# Altium project STLINKV2.PrjPcb (part 1 of 2)
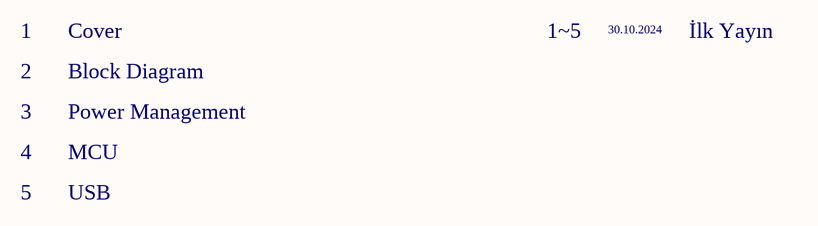
[diagram p0: Cover.SchDoc]
SheetSize: A3; ReleaseDate: 30.10.2024; ProjectDescription: STLINK_V2; PreparedBy: Aslı Kurt
5 sheets, 48 parts. Net scope: global (net labels, ports and power ports of the same name join across sheets).
Board file: STLINKV2.PcbDoc
Sheets:
  Cover.SchDoc
  BlockDiagram.SchDoc
  PowerManagement.SchDoc
  MCU.SchDoc
  USB.SchDoc

## Sheet Cover.SchDoc
size A3; SheetNumber: 1; SheetTotal: 5

### Notes on the sheet
- 1
- 2
- Cover
- Block Diagram
- 1~5
- 30.10.2024
- İlk Yayın
- 3
- Power Management
- 4
- 5
- MCU
- USB
- İÇİNDEKİLER / CONTENTS
- REVİZYON / REVISION
- ÜRETİM NOTLARI / PRODUCTION NOTES
- Sayfa Nu.
- Page No
- Açıklama / Description
- Tarih
- Date
- Board Features
- Kart Özellikleri
- Üretim Çıktıları
- Gerber Files
- Ekler
- Attachments
- İLETİŞİM / CONTACT
- DOSYA ADI / FILE NAME
- TANIM / DESCRIPTION
- HAZIRLAYAN / PREPARED BY
- YAYIN TARİHİ / REL. DATE
- BOYUT / SIZE
- SAYFA / SHEET
- /

## Sheet BlockDiagram.SchDoc
size A3; SheetNumber: 2; SheetTotal: 5
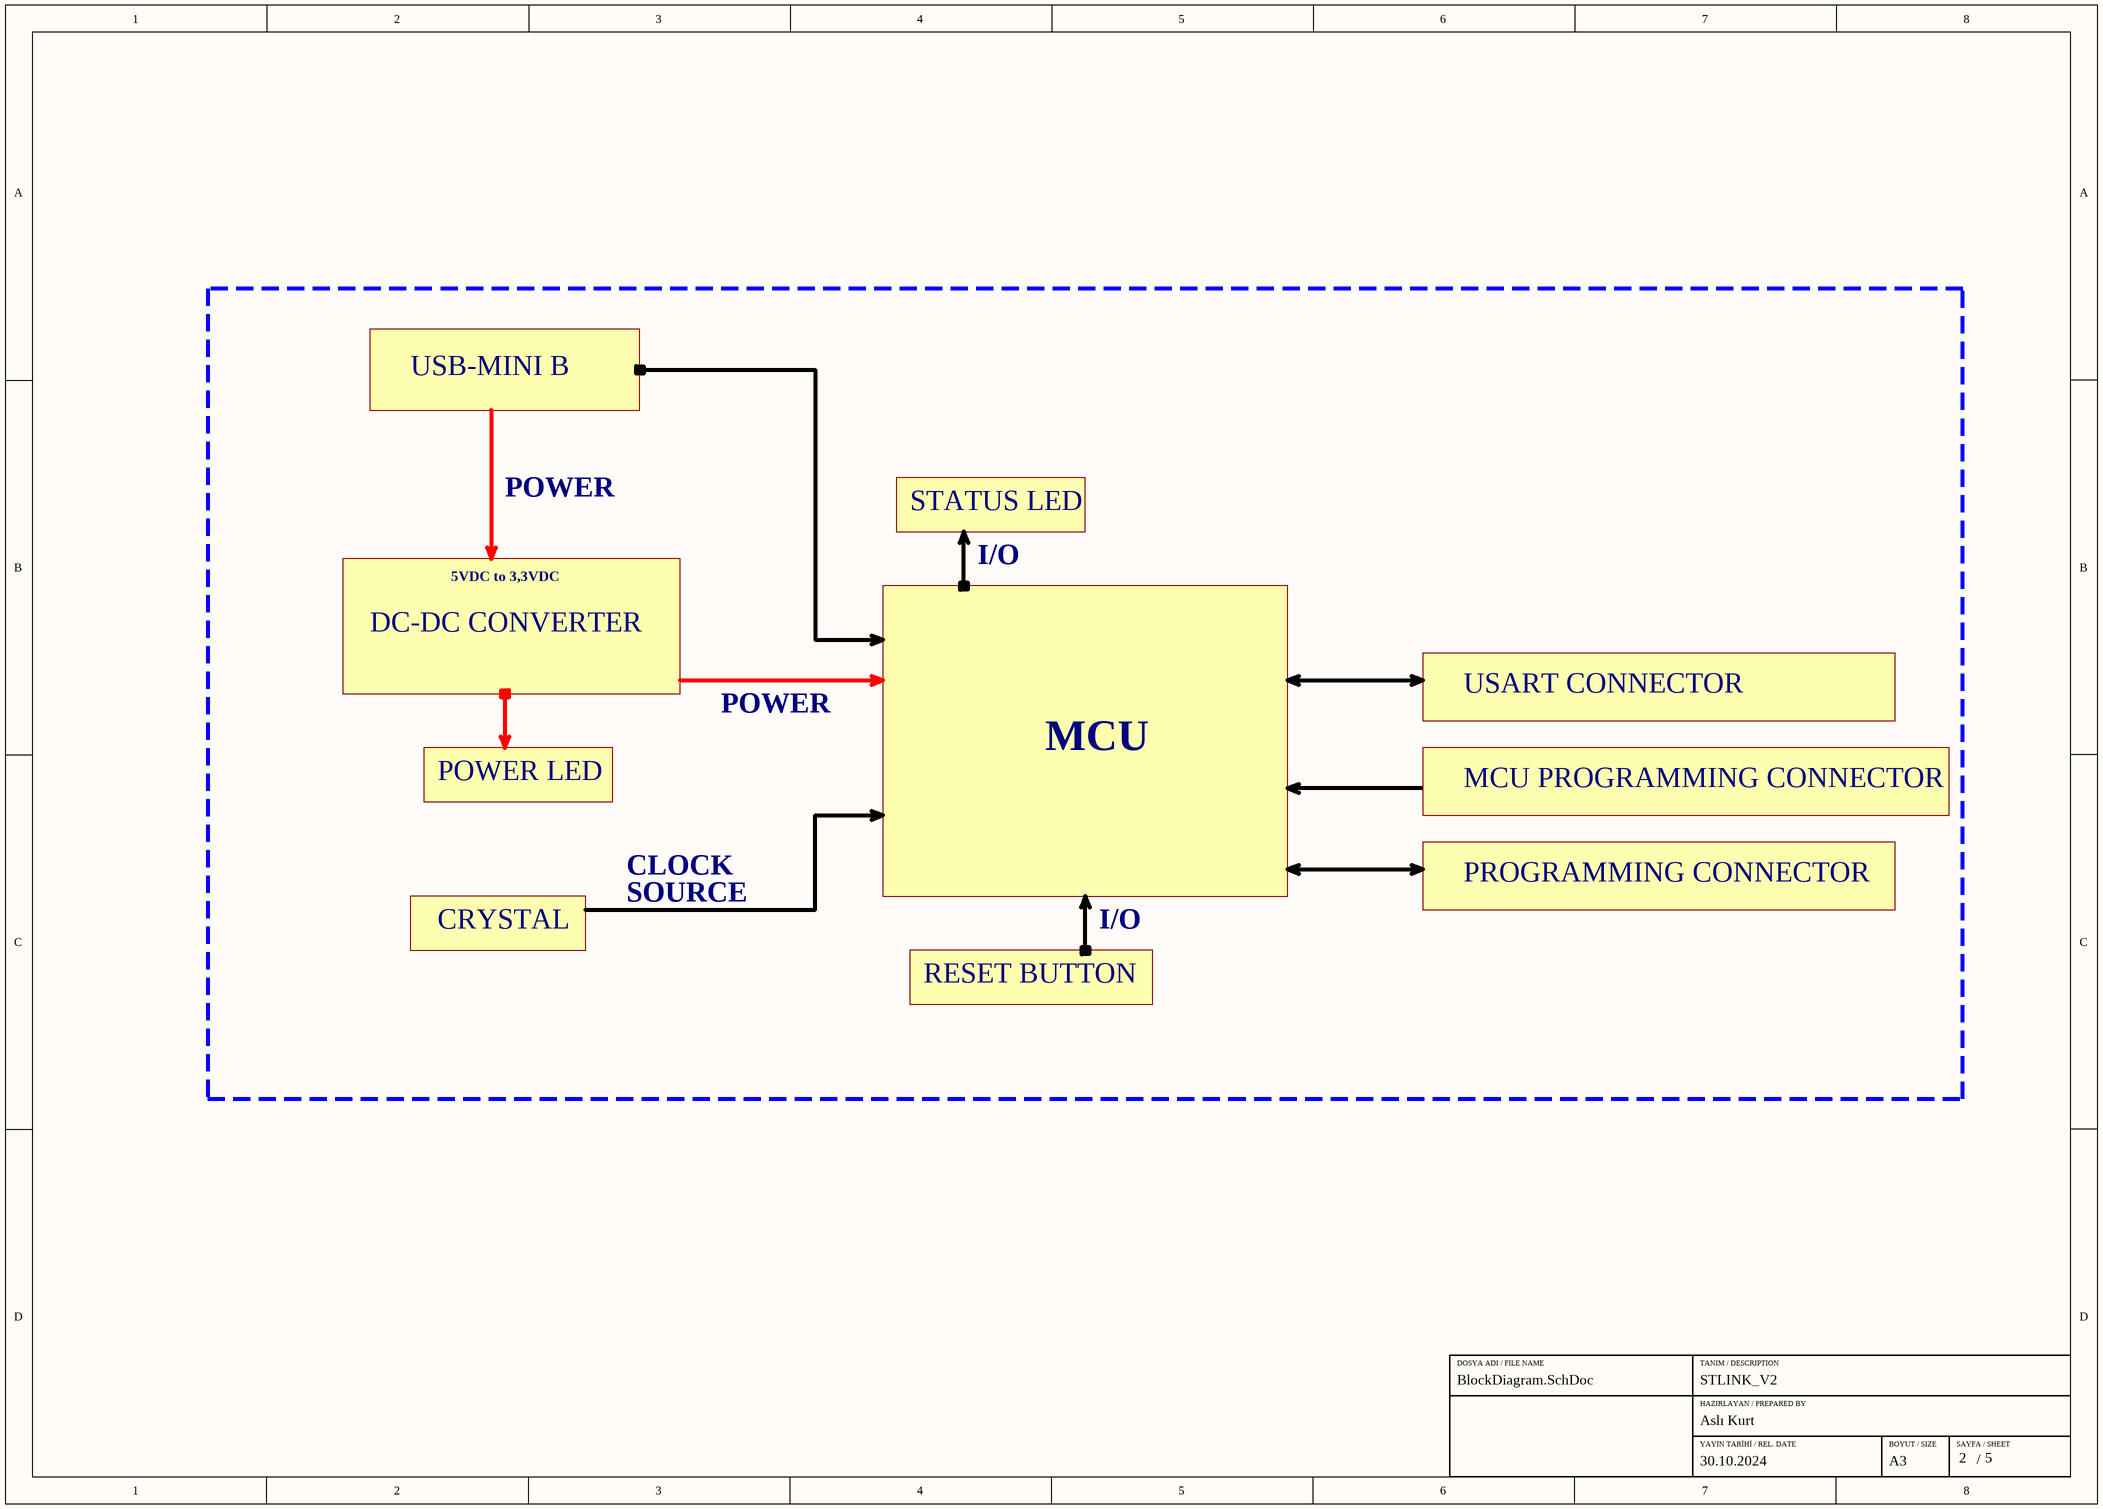
[diagram p1: BlockDiagram.SchDoc]

### Notes on the sheet
- USB-MINI B
- POWER
- STATUS LED
- 5VDC to 3,3VDC
- I/O
- DC-DC CONVERTER
- USART CONNECTOR
- POWER LED
- MCU
- MCU PROGRAMMING CONNECTOR
- CLOCK
- SOURCE
- PROGRAMMING CONNECTOR
- CRYSTAL
- RESET BUTTON
- DOSYA ADI / FILE NAME
- TANIM / DESCRIPTION
- HAZIRLAYAN / PREPARED BY
- YAYIN TARİHİ / REL. DATE
- BOYUT / SIZE
- SAYFA / SHEET
- /

## Sheet PowerManagement.SchDoc
size A3; SheetNumber: 3; SheetTotal: 5
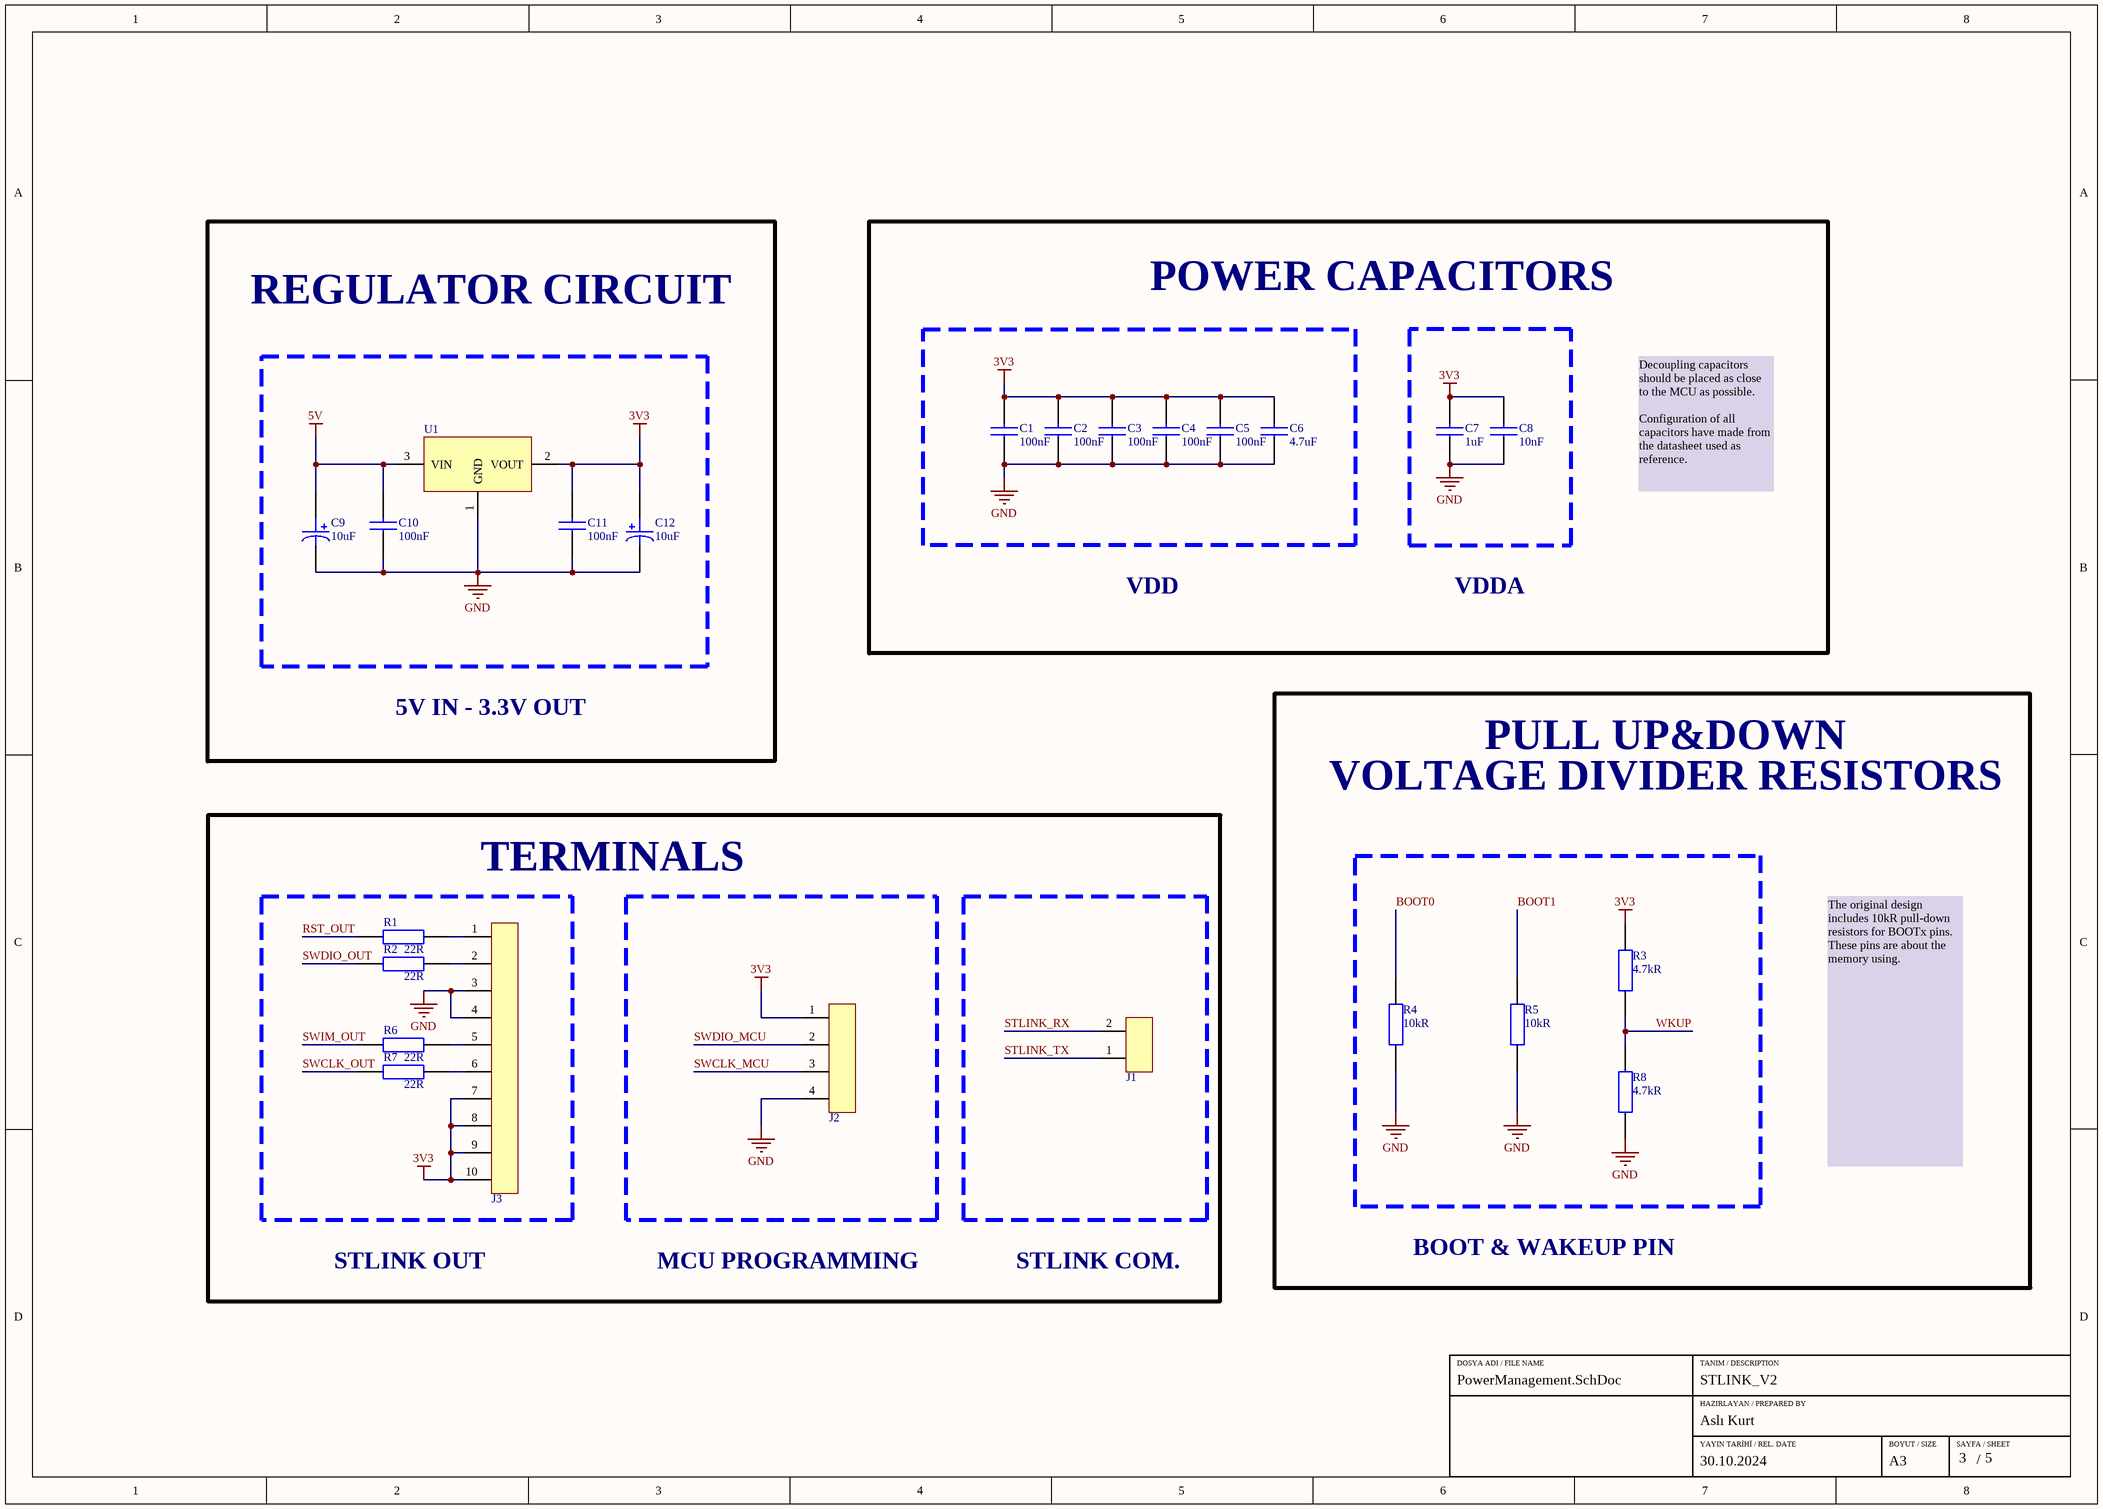
[diagram p2: PowerManagement.SchDoc]

### Parts
C1  Capacitance: 100nF  [CAP_0603]  (hidden comment: C0603C104K5RACTU)
C2  Capacitance: 100nF  [CAP_0603]  (hidden comment: C0603C104K5RACTU)
C3  Capacitance: 100nF  [CAP_0603]  (hidden comment: C0603C104K5RACTU)
C4  Capacitance: 100nF  [CAP_0603]  (hidden comment: C0603C104K5RACTU)
C5  Capacitance: 100nF  [CAP_0603]  (hidden comment: C0603C104K5RACTU)
C6  Capacitance: 4.7uF  [CAP_0805]  (hidden comment: CL21A475KAQNNNE)
C7  Capacitance: 1uF  [CAP_0805]  (hidden comment: CL21B105KBFNNNE)
C8  Capacitance: 10nF  [CAP_0603]  (hidden comment: 0603B103K160CT)
C9  Capacitance: 10uF  [CAP_1206_TANT]  (hidden comment: T491A106K010AT)
C10  Capacitance: 100nF  [CAP_0603]  (hidden comment: C0603C104K5RACTU)
C11  Capacitance: 100nF  [CAP_0603]  (hidden comment: C0603C104K5RACTU)
C12  Capacitance: 10uF  [CAP_1206_TANT]  (hidden comment: T491A106K010AT)
J1  61300211121  [2x1 Male Header 2.54mm]  (value not drawn)
J2  2.54mm  [4x1 Pinout]  (value not drawn)
J3  SBH11-PBPC-D05-RA-BK  [5x2 Male Header 2.54mm Shrouded - 4 Wall]  (value not drawn)
R1  Resistance: 22R  [RES_0201]  (hidden comment: AC0201FR-0722RL)
R2  Resistance: 22R  [RES_0201]  (hidden comment: AC0201FR-0722RL)
R3  Resistance: 4.7kR  [RES_0603]  (hidden comment: RC0603JR-074K7L)
R4  Resistance: 10kR  [RES_0603]  (hidden comment: RC0603FR-0710KL)
R5  Resistance: 10kR  [RES_0603]  (hidden comment: RC0603FR-0710KL)
R6  Resistance: 22R  [RES_0201]  (hidden comment: AC0201FR-0722RL)
R7  Resistance: 22R  [RES_0201]  (hidden comment: AC0201FR-0722RL)
R8  Resistance: 4.7kR  [RES_0603]  (hidden comment: RC0603JR-074K7L)
U1  LM1117MPX-33NOPB  [SOT223]  (value not drawn)

### Blocks framed on the sheet
REGULATOR CIRCUIT: C9-C12 U1
POWER CAPACITORS: C1-C8
TERMINALS: J1-J3 R1 R2 R6 R7

### Nets
3V3: C1.2 C2.2 C3.2 C4.2 C5.2 C6.2 C7.2 C8.2 C11.2 C12.1 J2.1 J3.7 J3.8 J3.9 J3.10 R3.2 U1.2(VOUT)
5V: C9.1 C10.2 U1.3(VIN)
GND: C1.1 C2.1 C3.1 C4.1 C5.1 C6.1 C7.1 C8.1 C9.2 C10.1 C11.1 C12.2 J2.4 J3.3 J3.4 R4.2 R5.2 R8.1 U1.1(GND)
BOOT0: R4.1
BOOT1: R5.1
RST_OUT: R1.1
STLINK_RX: J1.2
STLINK_TX: J1.1
SWCLK_MCU: J2.3
SWCLK_OUT: R7.1
SWDIO_MCU: J2.2
SWDIO_OUT: R2.1
SWIM_OUT: R6.1
WKUP: R3.1 R8.2
NetJ3_1: J3.1 R1.2
NetJ3_2: J3.2 R2.2
NetJ3_5: J3.5 R6.2
NetJ3_6: J3.6 R7.2

### Notes on the sheet
- Decoupling capacitors should be placed as close to the MCU as possible.
  Configuration of all capacitors have made from the datasheet used as reference.
- VDD
- VDDA
- 5V IN - 3.3V OUT
- PULL UP&DOWN
- VOLTAGE DIVIDER RESISTORS
- The original design includes 10kR pull-down resistors for BOOTx pins. These pins are about the memory using.
- STLINK OUT
- MCU PROGRAMMING
- STLINK COM.
- BOOT & WAKEUP PIN
- DOSYA ADI / FILE NAME
- TANIM / DESCRIPTION
- HAZIRLAYAN / PREPARED BY
- YAYIN TARİHİ / REL. DATE
- BOYUT / SIZE
- SAYFA / SHEET
- /

### Library data of the parts
C1-C5 C10 C11 = CAP CER 100nF 0603: CAP CER 100nF %10 0603 SMD; Manufacturer: KEMET; DesignedBy: Aslı Kurt; Dielectric Material: Ceramic; Voltage Rating (DC): 50V; Tolerance: 10%; Dielectric: X7R; Dissipation Factor: 2.5%; Supplier 1: Digi-Key; Manufacturer Part Number: C0603C104K5RACTU; RoHS: Yes; Category: Ceramic Capacitors; Stock 1: 1666186; Pricing 1: 1=0,12000, 10=0,08500, 50=0,04620, 100=0,03770, 500=0,02696, 1000=0,02118 (USD); Mount: Surface Mount; Case/Package: 0603; Number of Pins: 2; Case Code (Metric): 1608; Case Code (Imperial): 0603; Contact Plating: Tin,Matte; Min Operating Temperature: -55°C; Max Operating Temperature: 125°C; Packaging: Tape and Reel; Package Quantity: 1; Termination: SMD/SMT; Voltage: 50V; Voltage Rating: 50V; Series: SMD Comm X7R; Length: 0.063inch; Width: 0.031inch; Height: 0.8mm; Thickness: 0.034inch; Lead Pitch: 0.7mm; Depth: 0.8mm; Radiation Hardening: No; RoHS Compliant: Yes; REACH SVHC: No SVHC; ComponentLink1URL: https://datasheet.ciiva.com/7823/kem-c1002-x7r-smd-7823591.pdf?src-supplier=Element14; ComponentLink1Description: https://datasheet.ciiva.com/7823/kem-c1002-x7r-smd-7823591.pdf?src-supplier=Element14; ComponentLink2URL: https://datasheet.ciiva.com/14602/70095383-14602583.pdf?src-supplier=Allied+Electronics; ComponentLink2Description: https://datasheet.ciiva.com/14602/70095383-14602583.pdf?src-supplier=Allied+Electronics; ComponentLink3URL: https://datasheet.ciiva.com/5999/kem-c1002-x7r-smd-5999400.pdf?src-supplier=Farnell; ComponentLink3Description: https://datasheet.ciiva.com/5999/kem-c1002-x7r-smd-5999400.pdf?src-supplier=Farnell; ComponentLink4URL: https://datasheet.ciiva.com/7823/kem-c1002-x7r-smd-7823592.pdf?src-supplier=Element14; ComponentLink4Description: https://datasheet.ciiva.com/7823/kem-c1002-x7r-smd-7823592.pdf?src-supplier=Element14; ComponentLink5URL: https://datasheet.ciiva.com/28645/1851736-28645640.pdf?src-supplier=Element14; ComponentLink5Description: https://datasheet.ciiva.com/28645/1851736-28645640.pdf?src-supplier=Element14; ComponentLink6URL: https://datasheet.ciiva.com/14585/70095383-14585209.pdf?src-supplier=Allied+Electronics; ComponentLink6Description: https://datasheet.ciiva.com/14585/70095383-14585209.pdf?src-supplier=Allied+Electronics; Supplier Part Number 1: 399-5089-1-ND
C6 = CAP CER 4.7uF 0805: CAP CER 4.7uF %10 0805; Manufacturer: Samsung; Tolerance: 10%; Voltage Rating: 25V; Dielectric: X5R; DesignedBy: Aslı Kurt; Supplier 1: Digi-Key; Manufacturer Part Number: CL21A475KAQNNNE; RoHS: Yes; Category: Ceramic Capacitors; Stock 1: 1477018; Pricing 1: 1=0,11000, 10=0,08100, 50=0,04580, 100=0,03800, 500=0,02664, 1000=0,02205 (USD); Mount: Surface Mount; Case/Package: 0805; Case Code (Metric): 2012; Case Code (Imperial): 0805; Min Operating Temperature: -55°C; Max Operating Temperature: 85°C; Package Quantity: 1; Packaging: Tape and Reel; Voltage Rating (DC): 25V; Series: CL; Construction: Flat; Length: 2mm; Width: 0.049inch; Height: 1.25mm; Thickness: 0.055inch; Depth: 1.25mm; Radiation Hardening: No; Lead Free: Lead Free; RoHS Compliant: Yes; ComponentLink1URL: https://datasheet.ciiva.com/25798/cl21a475kaqnnne-25798882.pdf?src-supplier=Digi-Key; ComponentLink1Description: https://datasheet.ciiva.com/25798/cl21a475kaqnnne-25798882.pdf?src-supplier=Digi-Key; Supplier Part Number 1: 1276-1244-1-ND
C7 = CAP CER 1uF 0805: CAP CER 1uF %10 0805; Manufacturer: Samsung; DesignedBy: Aslı Kurt; Tolerance: 10%; Voltage Rating: 50V; Dielectric: X7R; Supplier 1: Digi-Key; Manufacturer Part Number: CL21B105KBFNNNE; RoHS: Yes; Category: Ceramic Capacitors; Stock 1: 958000; Pricing 1: 2000=0,02138, 4000=0,01956 (USD); Mount: Surface Mount; Case/Package: 0805; Case Code (Metric): 2012; Case Code (Imperial): 0805; Min Operating Temperature: -55°C; Max Operating Temperature: 125°C; Packaging: Tape and Reel; Package Quantity: 1; Voltage: 50V; Series: CL; Construction: Flat; Length: 2mm; Width: 0.049inch; Height: 1.25mm; Thickness: 0.053inch; Depth: 1.25mm; Radiation Hardening: No; RoHS Compliant: Yes; ComponentLink1URL: https://datasheet.ciiva.com/25800/cl21b105kbfnnne-25800291.pdf?src-supplier=Digi-Key; ComponentLink1Description: https://datasheet.ciiva.com/25800/cl21b105kbfnnne-25800291.pdf?src-supplier=Digi-Key; ComponentLink2URL: https://datasheet.ciiva.com/16449/cl21b105kbfnnne-16449003.pdf?src-supplier=Future+Electronics; ComponentLink2Description: https://datasheet.ciiva.com/16449/cl21b105kbfnnne-16449003.pdf?src-supplier=Future+Electronics; ComponentLink3URL: https://datasheet.ciiva.com/26838/getdatasheetpartid-354075-26838668.pdf?src-supplier=Verical; ComponentLink3Description: https://datasheet.ciiva.com/26838/getdatasheetpartid-354075-26838668.pdf?src-supplier=Verical; Supplier Part Number 1: 1276-1029-2-ND
C8 = CAP CER 10nF 0603: CAP CER 10nF %10 0603; Manufacturer: Walsin Technologies; DesignedBy: Aslı Kurt; Tolerance: 10%; Dielectric: X7R; Voltage Rating: 16V; Supplier 1: Digi-Key; Manufacturer Part Number: 0603B103K160CT; RoHS: Yes; Category: Ceramic Capacitors; Stock 1: 102474; Pricing 1: 1=0,10000, 10=0,03600, 50=0,01940, 100=0,01590, 500=0,01136, 1000=0,00892 (USD); Case/Package: 0603; Case Code (Metric): 1608; Case Code (Imperial): 0603; Min Operating Temperature: -55°C; Max Operating Temperature: 125°C; Packaging: Tape and Reel; Voltage Rating (DC): 16V; Length: 1.6mm; Depth: 0.8mm; REACH SVHC: Unknown; RoHS Compliant: Yes; ComponentLink1URL: http://www.farnell.com/datasheets/1958513.pdf?src-supplier=Farnell; ComponentLink1Description: http://www.farnell.com/datasheets/1958513.pdf?src-supplier=Farnell; ComponentLink2URL: http://components.arrow.com/part/dataview/0323_00656382?src-supplier=Arrow+Europe; ComponentLink2Description: http://components.arrow.com/part/dataview/0323_00656382?src-supplier=Arrow+Europe; ComponentLink3URL: http://www.farnell.com/datasheets/1958513.pdf?src-supplier=Element14; ComponentLink3Description: http://www.farnell.com/datasheets/1958513.pdf?src-supplier=Element14; ComponentLink4URL: http://www.passivecomponent.com/wp-content/uploads/2018/10/MLCC.pdf?src-supplier=Digi-Key; ComponentLink4Description: http://www.passivecomponent.com/wp-content/uploads/2018/10/MLCC.pdf?src-supplier=Digi-Key; Supplier Part Number 1: 1292-1384-1-ND
C9 C12 = CAP TANT 10uF 1206: Cap Tant Solid 10uF 10V A CASE 10% (3.2 X 1.6 X 1.6mm) SMD 3216-18 4 Ohm 125 C T/R; Manufacturer: KEMET; DesignedBy: Aslı Kurt; Dielectric Material: Tantalum; ESR (Equivalent Series Resistance): 4R; Dissipation Factor: 6%; Ripple Current: 137mA; Leakage Current: 1uA; Polarity: Polar; Supplier 1: Digikey; Manufacturer Part Number: T491A106K010AT; RoHS: Yes; Category: Tantalum Capacitors; Stock 1: 1419669; Pricing 1: 1=0,32, 10=0,209, 50=0,154, 100=0,1255, 500=0,09904, 1000=0,08364 (USD); Mount: Surface Mount,PCB; Case/Package: 1206; Case Code (Metric): 3216; Case Code (Imperial): 1206; Min Operating Temperature: -55°C; Max Operating Temperature: 125°C; Voltage Rating: 10V; Tolerance: 10%; Packaging: Tape and Reel; Features: General Purpose; Series: T491; Voltage Rating (DC): 10V; Package Quantity: 1; Termination: SMD/SMT; Construction: Flat; Voltage: 10V; Length: 3.2mm; Width: 0.063inch; Height: 1.6mm; Height - Seated (Max): 0.071inch; Depth: 1.6mm; Size: 1.6mm; RoHS Compliant: Yes; Lead Free: 5697LeadFree; Reach SVHC Compliant: No; ComponentLink1URL: https://datasheet.ciiva.com/7668/1732743-7668006.pdf?src-supplier=Element14; ComponentLink1Description: https://datasheet.ciiva.com/7668/1732743-7668006.pdf?src-supplier=Element14; ComponentLink2URL: https://datasheet.ciiva.com/27052/1573249-27052559.pdf?src-supplier=Jameco; ComponentLink2Description: https://datasheet.ciiva.com/27052/1573249-27052559.pdf?src-supplier=Jameco; ComponentLink3URL: https://datasheet.ciiva.com/257/kem-t2005-t491-257584.pdf?src-supplier=Digikey; ComponentLink3Description: https://datasheet.ciiva.com/257/kem-t2005-t491-257584.pdf?src-supplier=Digikey; ComponentLink4URL: https://datasheet.ciiva.com/11793/0900766b80718482-11793106.pdf?src-supplier=Rs; ComponentLink4Description: https://datasheet.ciiva.com/11793/0900766b80718482-11793106.pdf?src-supplier=Rs; ComponentLink5URL: https://datasheet.ciiva.com/7668/kem-t2005-t491-7668139.pdf?src-supplier=Element14; ComponentLink5Description: https://datasheet.ciiva.com/7668/kem-t2005-t491-7668139.pdf?src-supplier=Element14; ComponentLink6URL: https://datasheet.ciiva.com/7668/1854511-7668007.pdf?src-supplier=Element14; ComponentLink6Description: https://datasheet.ciiva.com/7668/1854511-7668007.pdf?src-supplier=Element14; ComponentLink7URL: https://datasheet.ciiva.com/7668/1446014-7668008.pdf?src-supplier=Element14; ComponentLink7Description: https://datasheet.ciiva.com/7668/1446014-7668008.pdf?src-supplier=Element14; ComponentLink8URL: https://datasheet.ciiva.com/7668/1854511-7668005.pdf?src-supplier=Element14; ComponentLink8Description: https://datasheet.ciiva.com/7668/1854511-7668005.pdf?src-supplier=Element14; ComponentLink9URL: https://datasheet.ciiva.com/257/kem-t2005-t491-257585.pdf?src-supplier=Digikey; ComponentLink9Description: https://datasheet.ciiva.com/257/kem-t2005-t491-257585.pdf?src-supplier=Digikey; ComponentLink10URL: https://datasheet.ciiva.com/257/kem-t2005-t491-257586.pdf?src-supplier=Digikey; ComponentLink10Description: https://datasheet.ciiva.com/257/kem-t2005-t491-257586.pdf?src-supplier=Digikey; ComponentLink11URL: https://datasheet.ciiva.com/14586/70095774-14586699.pdf?src-supplier=Allied+Electronics; ComponentLink11Description: https://datasheet.ciiva.com/14586/70095774-14586699.pdf?src-supplier=Allied+Electronics; ComponentLink12URL: https://datasheet.ciiva.com/14596/70095774-14596972.pdf?src-supplier=Allied+Electronics; ComponentLink12Description: https://datasheet.ciiva.com/14596/70095774-14596972.pdf?src-supplier=Allied+Electronics; ComponentLink13URL: https://datasheet.ciiva.com/12882/kem-t2005-t491-12882826.pdf?src-supplier=Mouser; ComponentLink13Description: https://datasheet.ciiva.com/12882/kem-t2005-t491-12882826.pdf?src-supplier=Mouser; ComponentLink14URL: https://datasheet.ciiva.com/29244/458293-da-01-en-kondensator-10uf-3216-10pr-10v-85c-29244583.pdf?src-supplier=Conrad; ComponentLink14Description: https://datasheet.ciiva.com/29244/458293-da-01-en-kondensator-10uf-3216-10pr-10v-85c-29244583.pdf?src-supplier=Conrad; Supplier Part Number 1: 399-3684-1-ND
J1 = 2x1 Male Header 2.54mm: DesignedBy: Aslı Kurt
J2 = 4x1 Pinout
J3 = 5x2 Male Header 2.54mm Shrouded - 4 Wall: Conn Shrouded Header (4 Sides) HDR 10 POS 2.54mm Solder RA Side Entry Thru-Hole; Manufacturer: Sullins; DesignedBy: Aslı Kurt; Supplier 1: Future Electronics; Manufacturer Part Number: SBH11-PBPC-D05-RA-BK; RoHS: Yes; Category: Connectors; Stock 1: 2002; Pricing 1: 1=0,415, 100=0,4, 300=0,385, 1000=0,37, 3000=0,345 (USD); Lead Free: 5697LeadFree; ComponentLink1URL: http://www.sullinscorp.com/catalogs/145_11_SERIES,_.100_BOX_HEADER.pdf?src-supplier=Future+Electronics; ComponentLink1Description: http://www.sullinscorp.com/catalogs/145_11_SERIES,_.100_BOX_HEADER.pdf?src-supplier=Future+Electronics; ComponentLink2URL: https://s3.amazonaws.com/catalogspreads-pdf/PAGE122%20.100%20SBH11%20SERIES%20MALE%20BOX%20HDR%20ST%20RA%20SMT.pdf?src-supplier=Digikey; ComponentLink2Description: https://s3.amazonaws.com/catalogspreads-pdf/PAGE122%20.100%20SBH11%20SERIES%20MALE%20BOX%20HDR%20ST%20RA%20SMT.pdf?src-supplier=Digikey; ComponentLink3URL: https://datasheet.octopart.com/SBH11-PBPC-D05-RA-BK-Sullins-datasheet-41399312.pdf?src-supplier=Future+Electronics; ComponentLink3Description: https://datasheet.octopart.com/SBH11-PBPC-D05-RA-BK-Sullins-datasheet-41399312.pdf?src-supplier=Future+Electronics; Supplier 2: Digikey; Stock 2: 10727; Pricing 2: 1=0,73, 10=0,559, 80=0,43988, 440=0,36386, 1000=0,33318, 5000=0,2847 (USD); Supplier Part Number 1: 3706876; Supplier Part Number 2: S9177-ND
R1 R2 R6 R7 = RES 22 OHM 0201: SMD Chip Resistor, 22 Ohm, ± 1%, 50 mW, 0201 [0603 Metric], Thick Film, General Purpose; Manufacturer: Yageo; DesignedBy: Aslı Kurt; Supplier 1: Future Electronics; Manufacturer Part Number: AC0201FR-0722RL; RoHS: Yes; Category: Chip SMD Resistors; Stock 1: 10000; Pricing 1: 10000=0,0022, 40000=0,0022, 200000=0,0021, 400000=0,002, 1250000=0,0019 (USD); ComponentLink1URL: https://datasheet.octopart.com/AC0201FR-0722RL-Yageo-datasheet-151884373.pdf?src-supplier=Future+Electronics; ComponentLink1Description: https://datasheet.octopart.com/AC0201FR-0722RL-Yageo-datasheet-151884373.pdf?src-supplier=Future+Electronics; ComponentLink2URL: https://www.yageo.com/upload/media/product/productsearch/datasheet/rchip/PYu-AC_51_RoHS_L_7.pdf?src-supplier=Digikey; ComponentLink2Description: https://www.yageo.com/upload/media/product/productsearch/datasheet/rchip/PYu-AC_51_RoHS_L_7.pdf?src-supplier=Digikey; ComponentLink3URL: http://www.yageo.com/NewPortal/yageodocoutput?fileName=/pdf/R-Chip/PYu-AC_51_RoHS_L_6.pdf&src-supplier=Digikey; ComponentLink3Description: http://www.yageo.com/NewPortal/yageodocoutput?fileName=/pdf/R-Chip/PYu-AC_51_RoHS_L_6.pdf&src-supplier=Digikey; Supplier 2: Avnet; Stock 2: 8618; Pricing 2: 1=0,012, 25=0,024, 100=0,015, 250=0,014, 1000=0,012 (USD); Supplier 3: Farnell; Stock 3: 49610; Pricing 3: 10=0,026, 100=0,016, 500=0,012, 2500=0,009, 5000=0,008, 10000=0,006, 50000=0,0055, 100000=0,005 (EUR); Supplier 4: Farnell; Stock 4: 49610; Pricing 4: 500=0,012, 2500=0,009, 5000=0,008, 10000=0,006, 50000=0,0055, 100000=0,005 (EUR); Supplier 5: Mouser; Stock 5: 31530; Pricing 5: 1=0,1, 10=0,024, 50=0,024, 100=0,015, 1000=0,012, 10000=0,006 (USD); Supplier 6: Newark; Stock 6: 10000; Pricing 6: 10000=0,009, 20000=0,008 (USD); Supplier 7: Digikey; Stock 7: 156463; Pricing 7: 1=0,1, 10=0,024, 50=0,0198, 500=0,0153, 1000=0,01224, 5000=0,0102 (USD); Supplier Part Number 1: 4087310; Supplier Part Number 2: 49AK0137; Supplier Part Number 3: 3495168; Supplier Part Number 5: 603-AC0201FR-0722RL; Supplier Part Number 4: 3495168RL; Supplier Part Number 6: 68AK3319; Supplier Part Number 7: YAG3420CT-ND
R3 R8 = RES 4K7 OHM 0603: RES 4K7 %5 OHM 0603 SMD; Manufacturer: Yageo; Tolerance: 5%; Temperature Coefficient: 100ppm/°C; Voltage Rating (DC): 50V; Power Rating: 100mW; DesignedBy: Aslı Kurt; Supplier 1: Digi-Key; Manufacturer Part Number: RC0603JR-074K7L; RoHS: Yes; Category: Chip SMD Resistors; Stock 1: 3901839; Pricing 1: 1=0,10000, 10=0,01900, 100=0,00770, 1000=0,00344, 2500=0,00298 (USD); Case/Package: 0603; Number of Pins: 2; Case Code (Imperial): 0603; Case Code (Metric): 1608; Size Code: 0603; Min Operating Temperature: -55°C; Max Operating Temperature: 155°C; Resistor Type: Thick Film; Packaging: Tape and Reel; Voltage Rating: 50V; Termination: SMD/SMT; Features: Moisture Resistant; Max Power Dissipation: 100mW; Number of Terminations: 2; Series: RC; Resistance Tolerance: 5%; Construction: Rectangular; Length: 1.6mm; Width: 0.8mm; Depth: 0.8mm; REACH SVHC: No SVHC; Lead Free: Lead Free; RoHS Compliant: Yes; Military Standard: Not; ComponentLink1URL: https://datasheet.ciiva.com/46412/443971-46412858.pdf?src-supplier=Element14; ComponentLink1Description: https://datasheet.ciiva.com/46412/443971-46412858.pdf?src-supplier=Element14; Supplier Part Number 1: 311-4.7KGRCT-ND
R4 R5 = RES 10K OHM 0603: RES 10K %1 OHM 0603 SMD; Manufacturer: Yageo; DesignedBy: Aslı Kurt; Tolerance: 1%; Temperature Coefficient: 100ppm/°C; Voltage Rating (DC): 50V; Power Rating: 100mW; Voltage Rating: 75V; Supplier 1: Digi-Key; Manufacturer Part Number: RC0603FR-0710KL; RoHS: Yes; Category: Chip SMD Resistors; Stock 1: 24140601; Pricing 1: 1=0,10000, 10=0,02300, 100=0,00930, 1000=0,00417, 2500=0,00362 (USD); Case/Package: 0603; Number of Pins: 2; Case Code (Imperial): 0603; Case Code (Metric): 1608; Weight: 7.1E-05oz; Size Code: 0603; Min Operating Temperature: -55°C; Max Operating Temperature: 155°C; Resistor Type: Thick Film; Packaging: Tape and Reel; Termination: SMD/SMT; Features: Moisture Resistant; Series: RC; Max Power Dissipation: 100mW; Number of Terminations: 2; Resistance Tolerance: 1%; Construction: Rectangular; Length: 1.6mm; Width: 0.8mm; Height: 0.45mm; Depth: 0.8mm; Lead Pitch: 0.3mm; REACH SVHC: Unknown; Lead Free: Lead Free; Military Standard: Not; RoHS Compliant: Yes; ComponentLink1URL: https://datasheet.ciiva.com/7660/38590-7660789.pdf?src-supplier=Element14; ComponentLink1Description: https://datasheet.ciiva.com/7660/38590-7660789.pdf?src-supplier=Element14; ComponentLink2URL: https://datasheet.ciiva.com/15189/getdatasheetpartid-409289-15189591.pdf?src-supplier=Verical; ComponentLink2Description: https://datasheet.ciiva.com/15189/getdatasheetpartid-409289-15189591.pdf?src-supplier=Verical; ComponentLink3URL: https://datasheet.ciiva.com/46440/1868787-46440891.pdf?src-supplier=Element14; ComponentLink3Description: https://datasheet.ciiva.com/46440/1868787-46440891.pdf?src-supplier=Element14; ComponentLink4URL: https://datasheet.ciiva.com/7983/443971-7983596.pdf?src-supplier=Element14; ComponentLink4Description: https://datasheet.ciiva.com/7983/443971-7983596.pdf?src-supplier=Element14; ComponentLink5URL: https://datasheet.ciiva.com/7746/1738695-7746239.pdf?src-supplier=Element14; ComponentLink5Description: https://datasheet.ciiva.com/7746/1738695-7746239.pdf?src-supplier=Element14; ComponentLink6URL: https://datasheet.ciiva.com/22747/443971-22747519.pdf?src-supplier=Element14; ComponentLink6Description: https://datasheet.ciiva.com/22747/443971-22747519.pdf?src-supplier=Element14; Supplier Part Number 1: 311-10.0KHRCT-ND
U1 = LM1117MPX-33NOPB: 800-mA 15-V linear voltage regulator ; 4-SOT-223 0 to 125; Manufacturer: Texas Instruments; Manufacturer Part Number: LM1117MPX-3.3/NOPB; DesignedBy: Aslı Kurt; Supplier 1: Mouser; RoHS: Yes; Category: Voltage Regulators - Linear; Stock 1: 43664; Pricing 1: 1=1,09, 10=0,715, 50=0,715, 100=0,573, 1000=0,511, 10000=0,445 (USD); Thickness: 1.6mm; Radiation Hardening: 5898YesNo; ComponentLink1URL: http://www.jameco.com/Jameco/Products/ProdDS/1282978.pdf?src-supplier=Jameco; ComponentLink1Description: http://www.jameco.com/Jameco/Products/ProdDS/1282978.pdf?src-supplier=Jameco; ComponentLink2URL: http://www.mouser.com/ds/2/405/snos412m-286860.pdf?src-supplier=Mouser; ComponentLink2Description: http://www.mouser.com/ds/2/405/snos412m-286860.pdf?src-supplier=Mouser; ComponentLink3URL: http://components.arrow.com/part/dataview/41724903S9714588N1317?src-supplier=Arrow+Electronics; ComponentLink3Description: http://components.arrow.com/part/dataview/41724903S9714588N1317?src-supplier=Arrow+Electronics; ComponentLink4URL: http://www.ti.com/general/docs/lit/getliterature.tsp?genericPartNumber=LM1117&fileType=pdf&src-supplier=Farnell; ComponentLink4Description: http://www.ti.com/general/docs/lit/getliterature.tsp?genericPartNumber=LM1117&fileType=pdf&src-supplier=Farnell; ComponentLink5URL: http://www.ti.com/general/docs/lit/getliterature.tsp?genericPartNumber=LM1117&&fileType=pdf&src-supplier=Farnell; ComponentLink5Description: http://www.ti.com/general/docs/lit/getliterature.tsp?genericPartNumber=LM1117&&fileType=pdf&src-supplier=Farnell; ComponentLink6URL: http://www.ti.com/lit/ds/symlink/lm1117.pdf?src-supplier=Digikey; ComponentLink6Description: http://www.ti.com/lit/ds/symlink/lm1117.pdf?src-supplier=Digikey; ComponentLink7URL: http://www.ti.com/general/docs/lit/getliterature.tsp?genericPartNumber=LM1117&fileType=pdf&src-supplier=Newark; ComponentLink7Description: http://www.ti.com/general/docs/lit/getliterature.tsp?genericPartNumber=LM1117&fileType=pdf&src-supplier=Newark; ComponentLink8URL: http://www.ti.com/general/docs/lit/getliterature.tsp?genericPartNumber=LM1117&&fileType=pdf&src-supplier=Avnet; ComponentLink8Description: http://www.ti.com/general/docs/lit/getliterature.tsp?genericPartNumber=LM1117&&fileType=pdf&src-supplier=Avnet; Supplier 2: Arrow Electronics; Stock 2: 94000; Pricing 2: 2000=0,4373, 4000=0,4373, 10000=0,4373, 24000=0,4373 (USD); Supplier 3: Digikey; Stock 3: 15236; Pricing 3: 1=1,15, 10=0,802, 25=0,7148, 100=0,6185, 250=0,5726, 500=0,54494, 1000=0,52214 (USD); Supplier 4: Farnell; Stock 4: 4117; Pricing 4: 100=0,651, 500=0,58, 1000=0,477 (EUR); Supplier 5: Rs; Stock 5: 3090; Pricing 5: 50=0,662, 100=0,596, 250=0,536, 500=0,51 (GBP); Supplier Part Number 1: 926-LM1117MPX3.3NOPB; Supplier Part Number 2: LM1117MPX-3.3/NOPB; Supplier Part Number 3: LM1117MPX-3.3/NOPBDKR-ND; Supplier Part Number 4: 3122024RL; Supplier Part Number 5: 2088523P